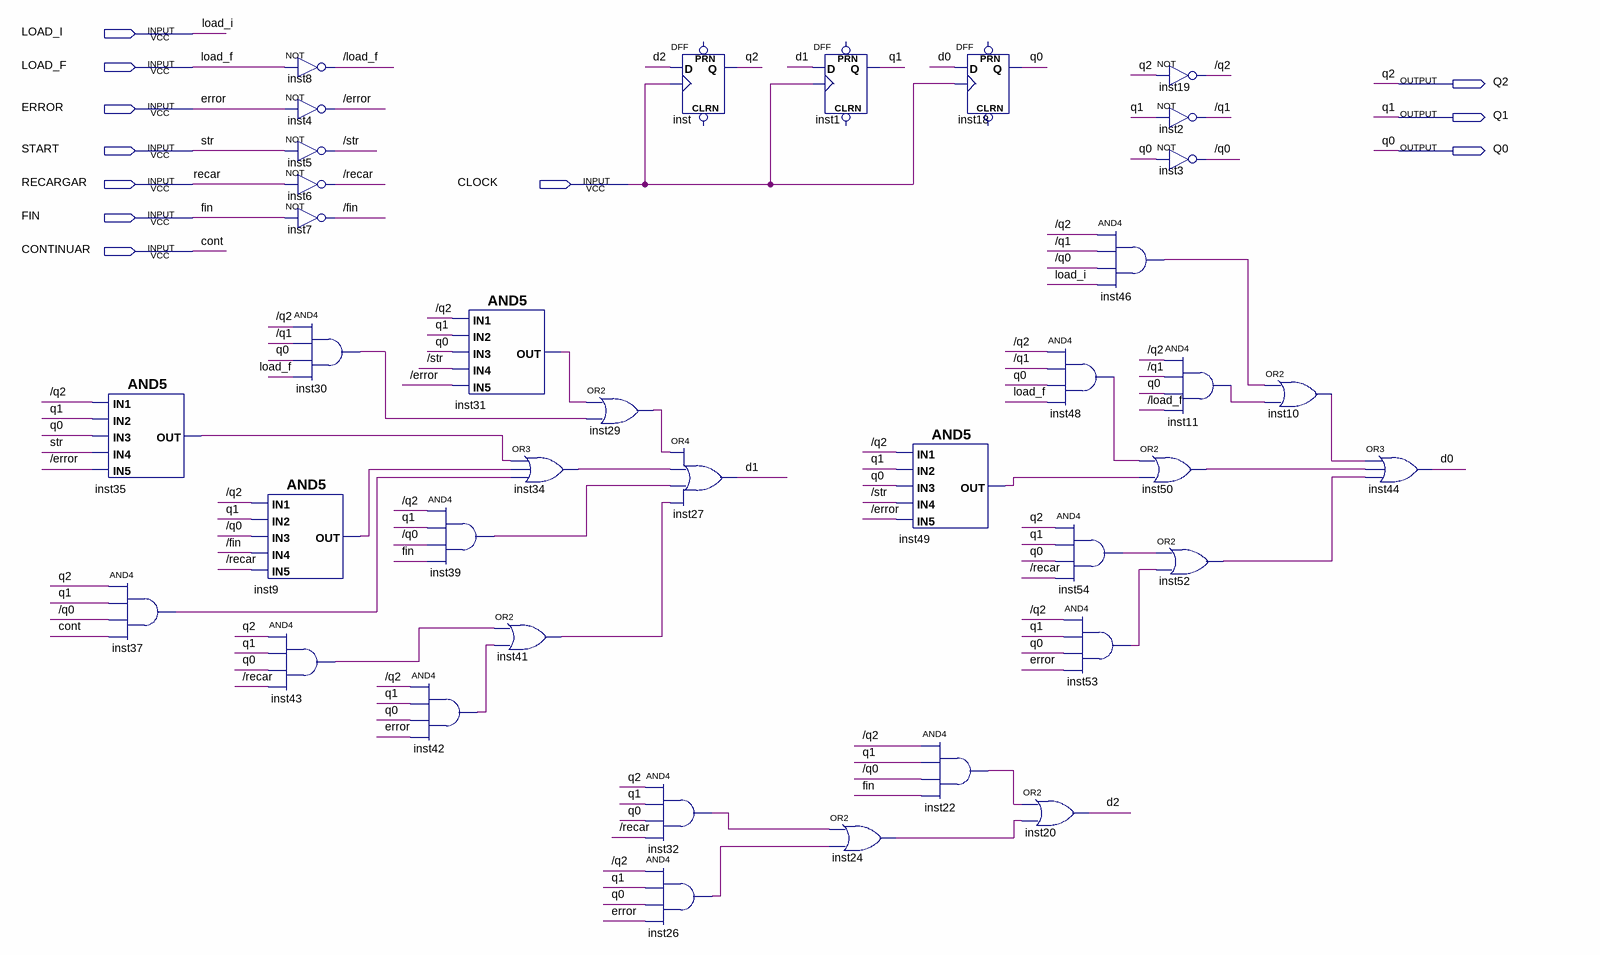
[diagram p0: schematic sheet]
// Quartus schematic mef.bdf as structural Verilog: 38 symbols, 11 pins
module mef (
  input  LOAD_I,
  input  LOAD_F,
  input  ERROR,
  input  START,
  input  RECARGAR,
  input  CLOCK,
  input  FIN,
  input  CONTINUAR,
  output Q2,
  output Q1,
  output Q0
);

  wire \/error , \/fin , \/load_f , \/q0 , \/q1 , \/q2 , \/recar , \/str , d0, d1, d2, inst9_out, inst10_out,
       inst11_out, inst22_out, inst24_out, inst26_out, inst29_out, inst30_out, inst31_out, inst32_out,
       inst34_out, inst35_out, inst37_out, inst39_out, inst41_out, inst42_out, inst43_out, inst46_out,
       inst48_out, inst49_out, inst50_out, inst52_out, inst53_out, inst54_out;

  and inst35 (inst35_out, \/q2 , Q1, Q0, START, \/error );
  and inst37 (inst37_out, Q2, Q1, \/q0 , CONTINUAR);
  and inst9 (inst9_out, \/q2 , Q1, \/q0 , \/fin , \/recar );
  and inst43 (inst43_out, Q2, Q1, Q0, \/recar );
  not inst8 (\/load_f , LOAD_F);
  not inst4 (\/error , ERROR);
  not inst5 (\/str , START);
  not inst6 (\/recar , RECARGAR);
  not inst7 (\/fin , FIN);
  and inst30 (inst30_out, \/q2 , \/q1 , Q0, LOAD_F);
  and inst31 (inst31_out, \/q2 , Q1, Q0, \/str , \/error );
  and inst39 (inst39_out, \/q2 , Q1, \/q0 , FIN);
  and inst42 (inst42_out, \/q2 , Q1, Q0, ERROR);
  or inst34 (inst34_out, inst35_out, inst9_out, inst37_out);
  or inst41 (inst41_out, inst43_out, inst42_out);
  or inst29 (inst29_out, inst31_out, inst30_out);
  DFF inst (.CLK(CLOCK), .D(d2), .Q(Q2));  // open: CLRN, PRN
  or inst27 (d1, inst29_out, inst34_out, inst39_out, inst41_out);
  and inst32 (inst32_out, Q2, Q1, Q0, \/recar );
  and inst26 (inst26_out, \/q2 , Q1, Q0, ERROR);
  DFF inst1 (.CLK(CLOCK), .D(d1), .Q(Q1));  // open: CLRN, PRN
  or inst24 (inst24_out, inst32_out, inst26_out);
  and inst49 (inst49_out, \/q2 , Q1, Q0, \/str , \/error );
  and inst22 (inst22_out, \/q2 , Q1, \/q0 , FIN);
  DFF inst18 (.CLK(CLOCK), .D(d0), .Q(Q0));  // open: CLRN, PRN
  and inst48 (inst48_out, \/q2 , \/q1 , Q0, LOAD_F);
  and inst54 (inst54_out, Q2, Q1, Q0, \/recar );
  and inst53 (inst53_out, \/q2 , Q1, Q0, ERROR);
  or inst20 (d2, inst22_out, inst24_out);
  and inst46 (inst46_out, \/q2 , \/q1 , \/q0 , LOAD_I);
  or inst50 (inst50_out, inst48_out, inst49_out);
  not inst19 (\/q2 , Q2);
  not inst2 (\/q1 , Q1);
  not inst3 (\/q0 , Q0);
  and inst11 (inst11_out, \/q2 , \/q1 , Q0, \/load_f );
  or inst52 (inst52_out, inst54_out, inst53_out);
  or inst10 (inst10_out, inst46_out, inst11_out);
  or inst44 (d0, inst10_out, inst50_out, inst52_out);

  // Other names for the same wires on the sheet: cont = CONTINUAR; recar = RECARGAR; str = START
endmodule
